# EAGLE board main (EAGLE 9.1.3), part 1 of 2
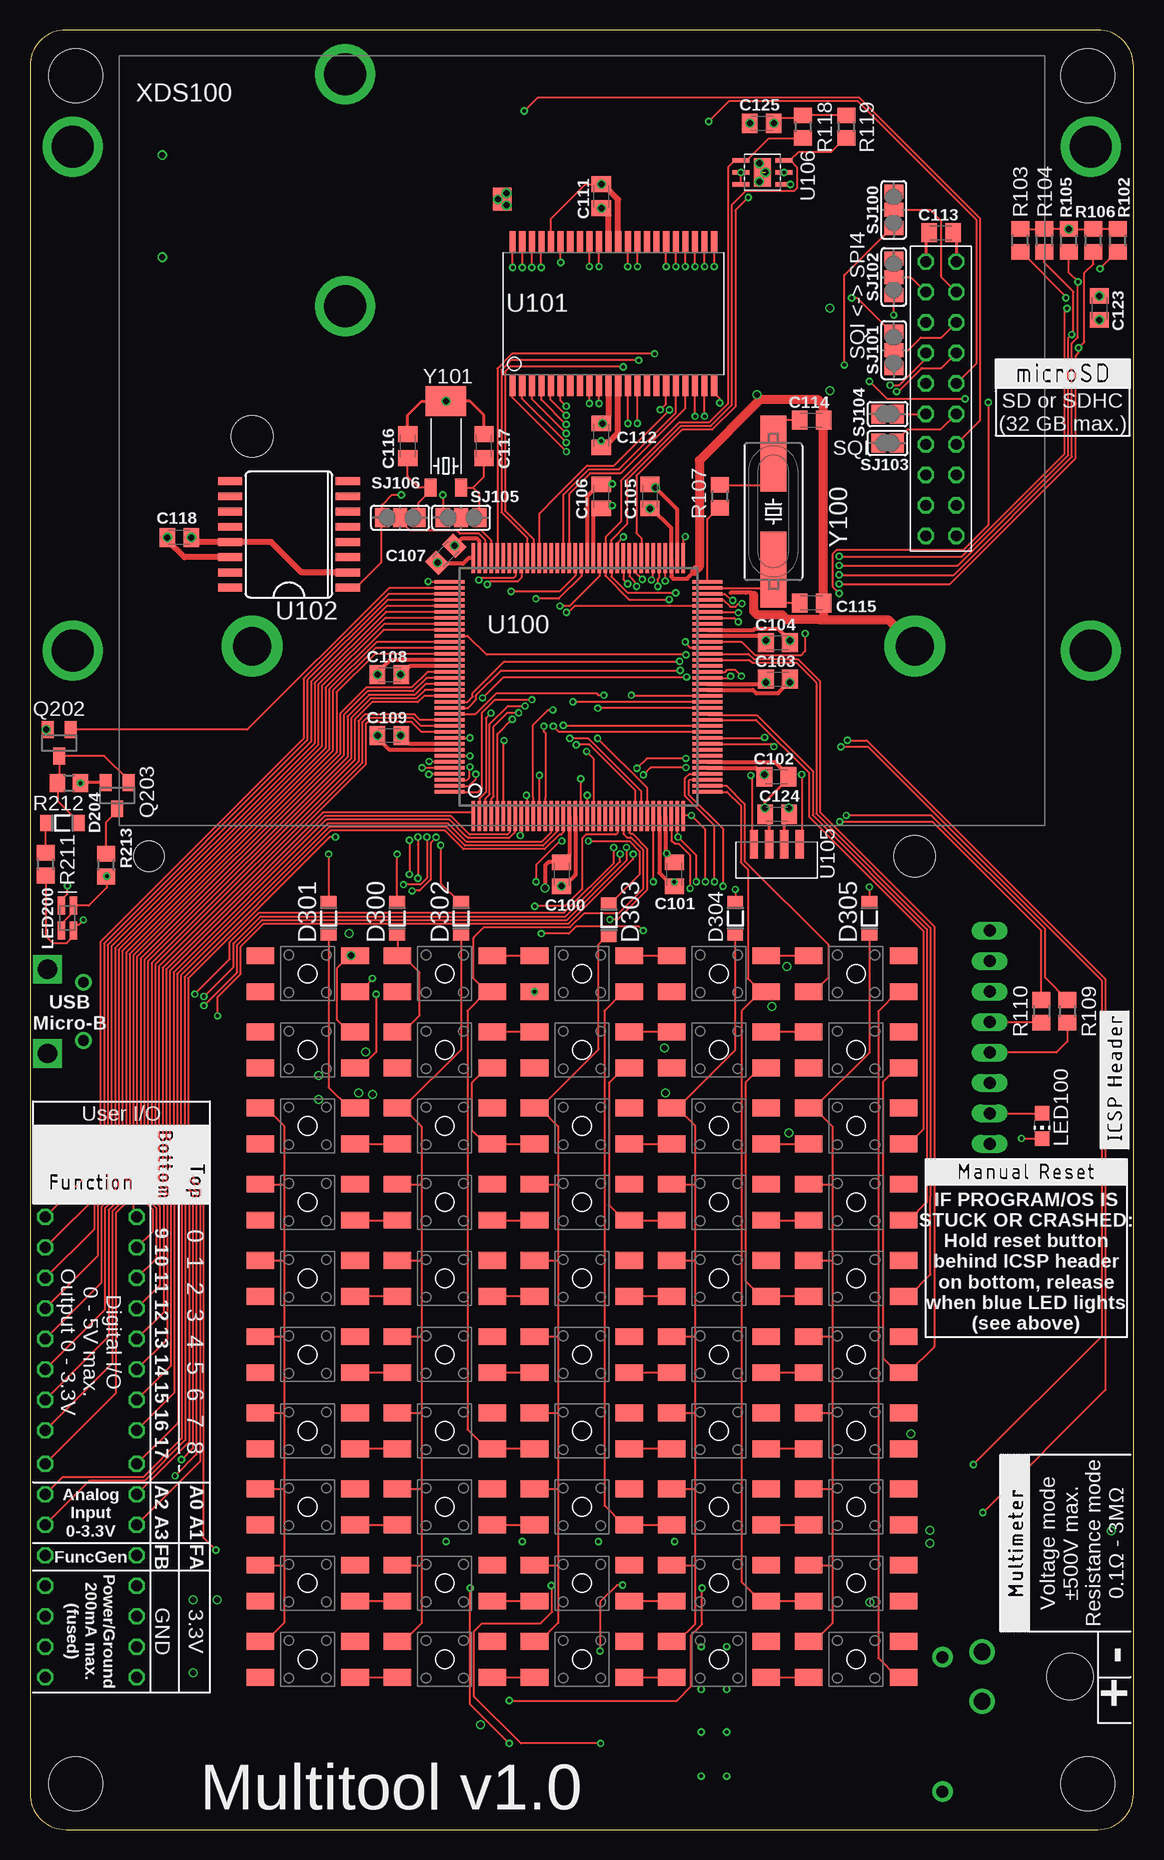
[diagram p7: board, top side]
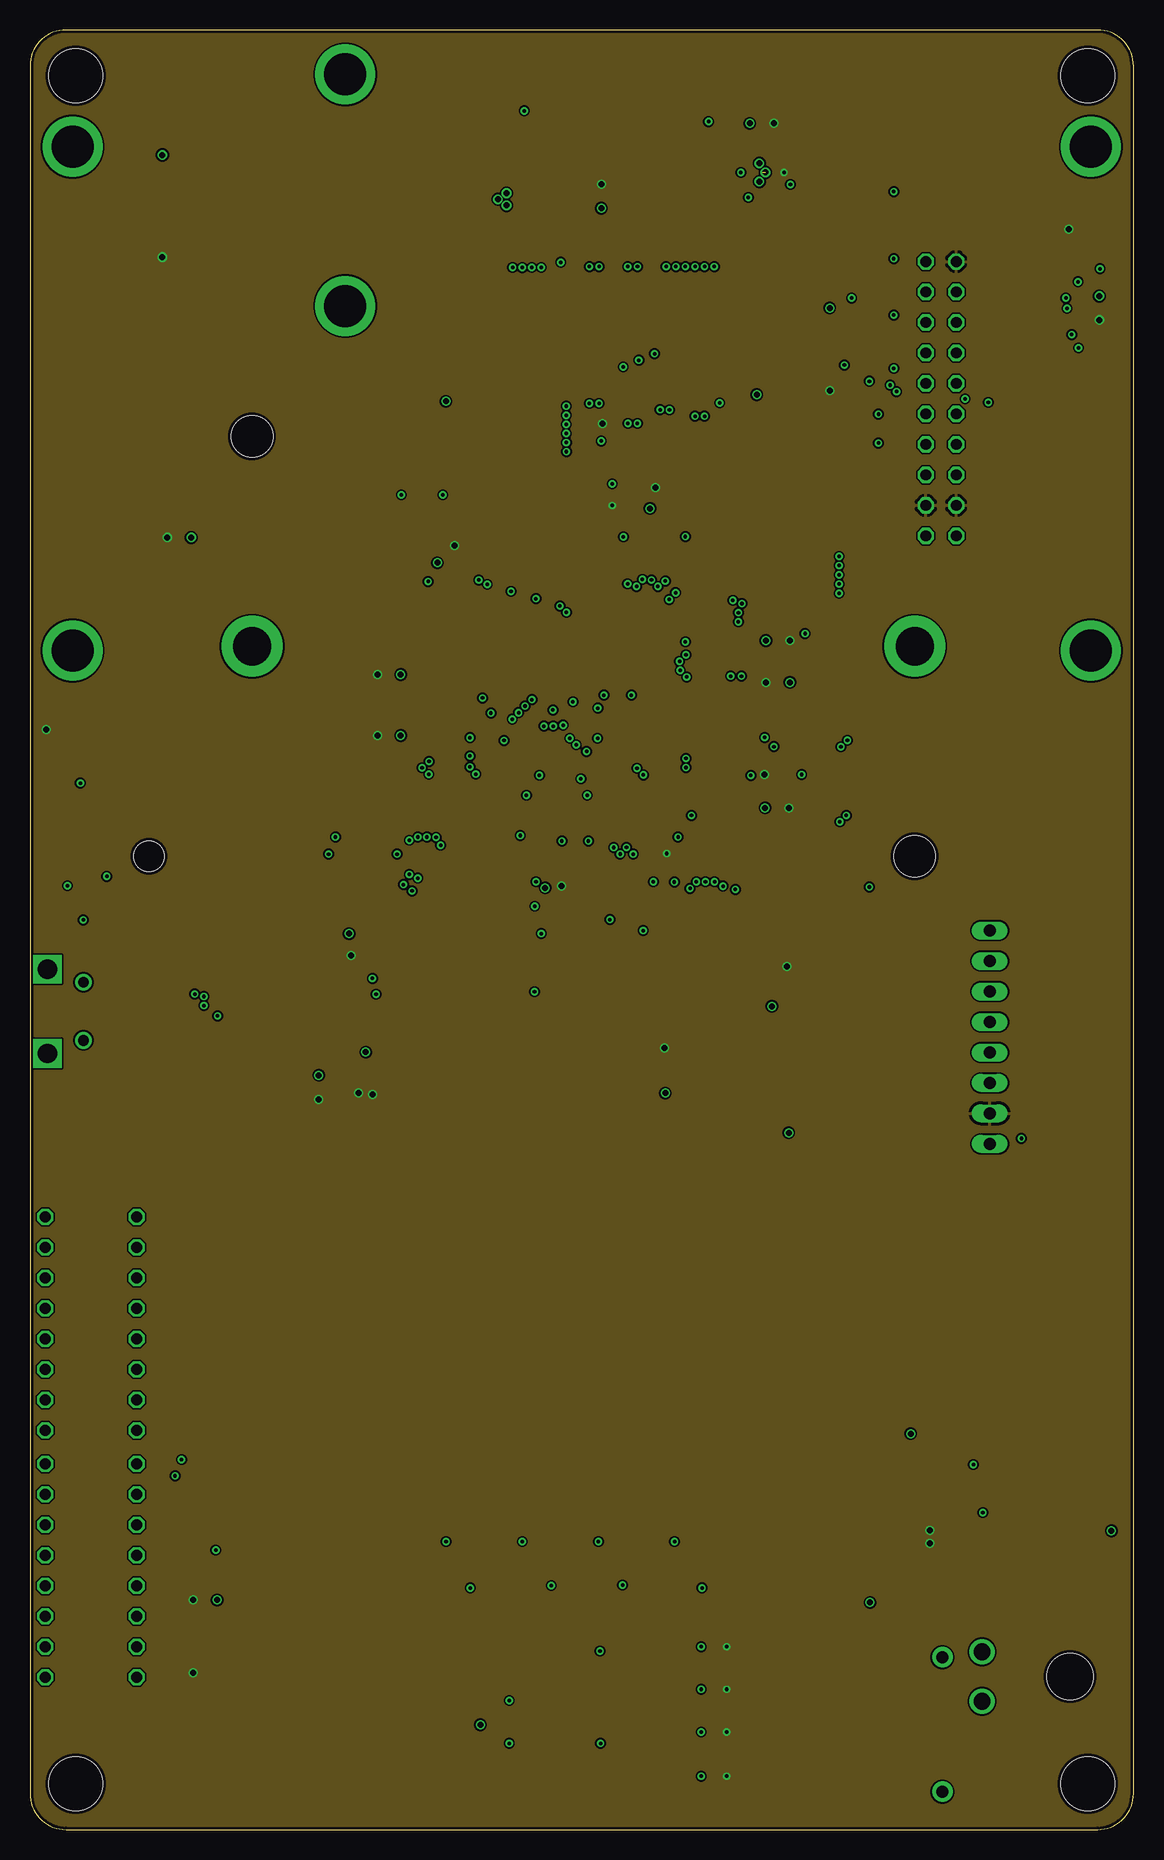
[diagram p8: board, inner layer Route2]
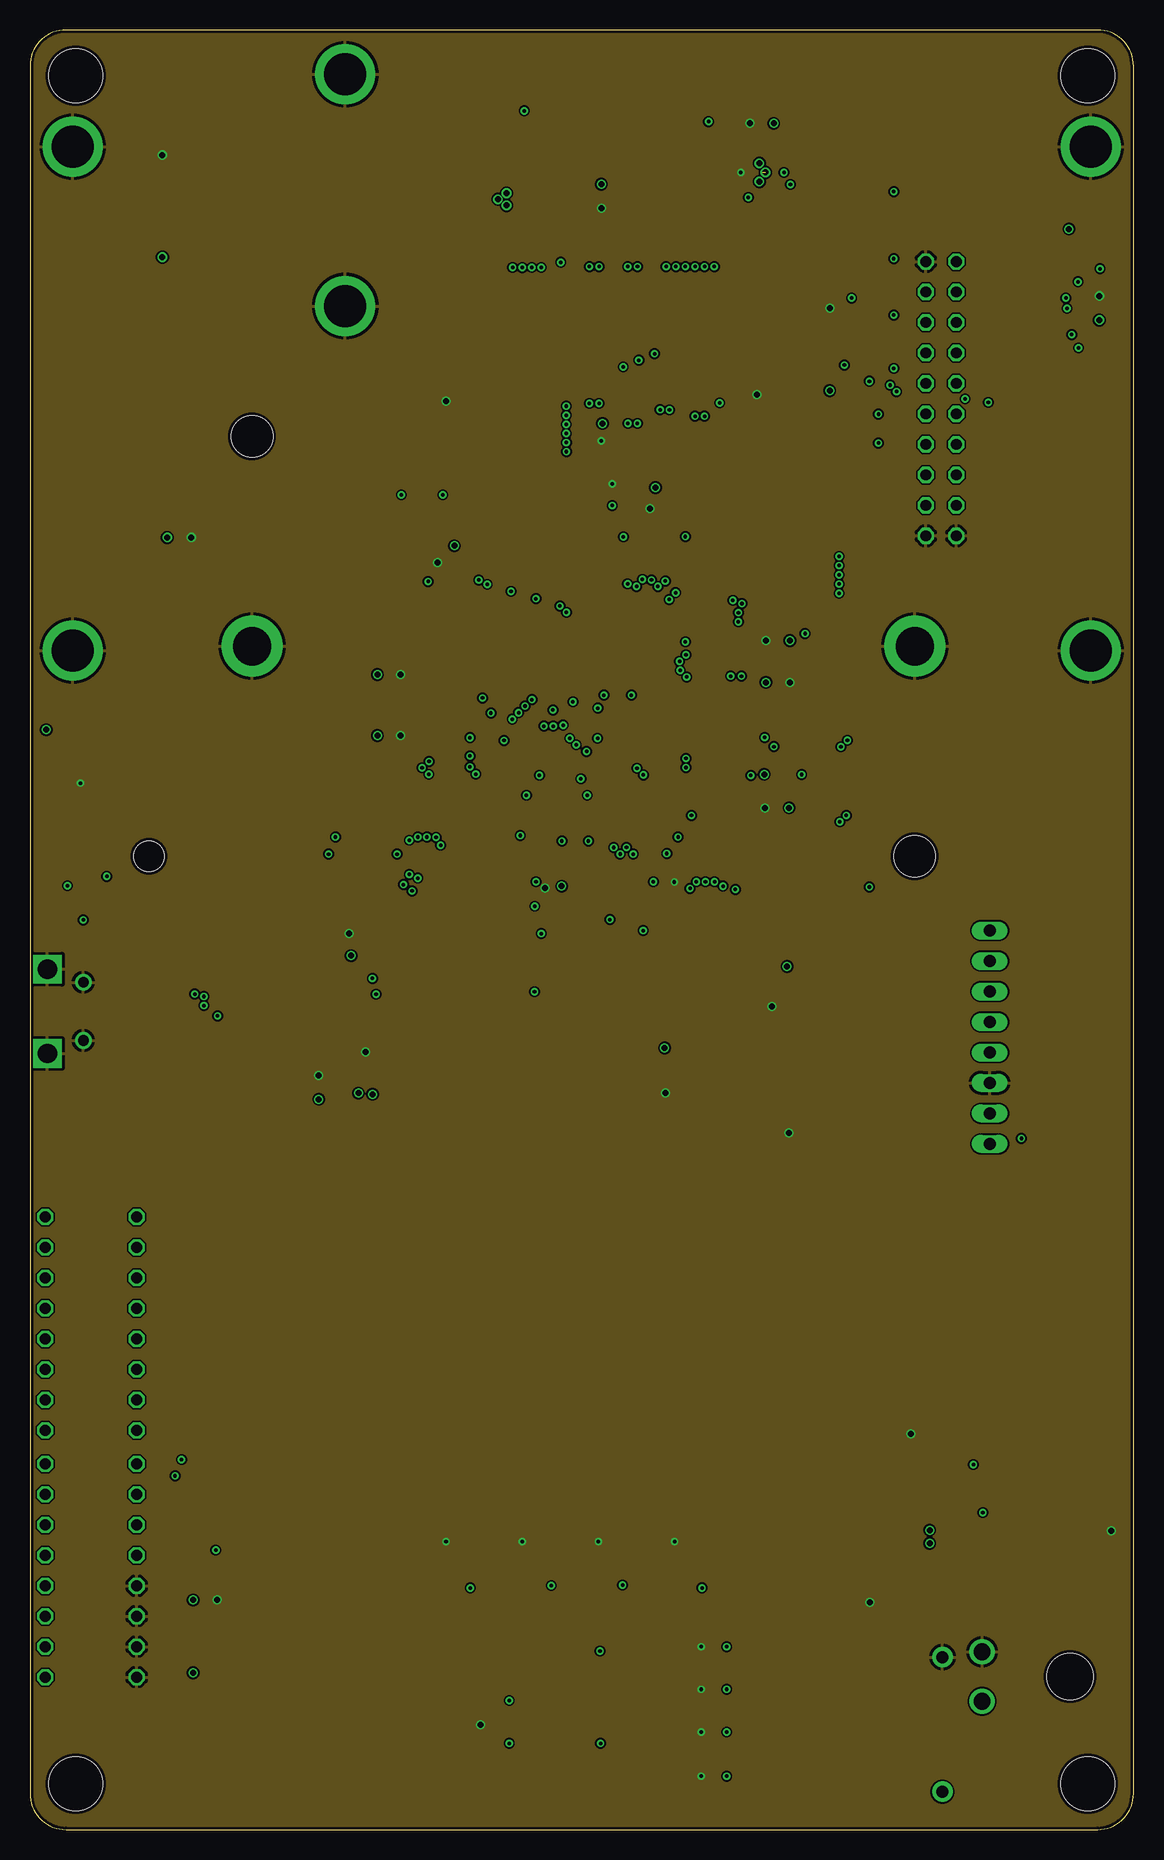
[diagram p9: board, inner layer Route15]
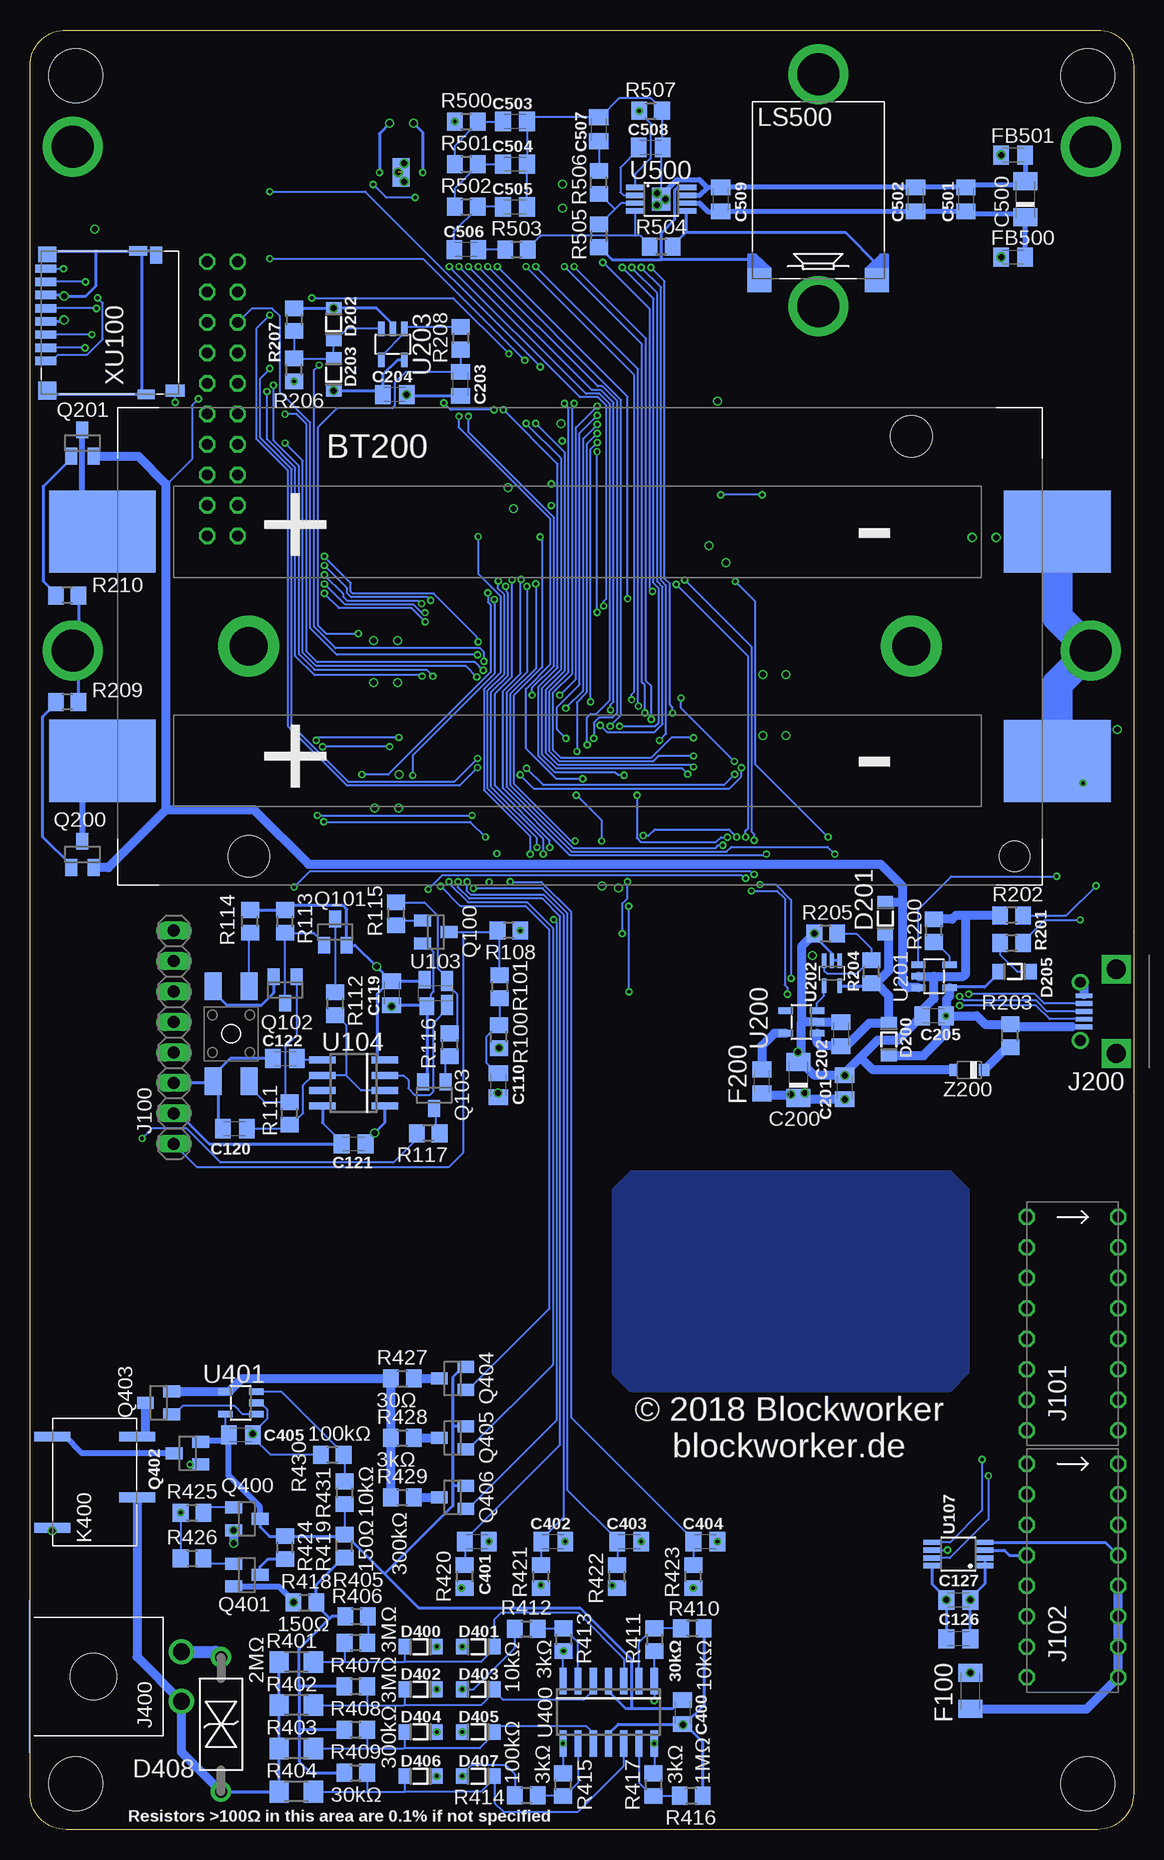
[diagram p10: board, bottom side, seen from below]

Size 92 x 150 mm. Coordinates in mm from the lower left corner, seen from the top.
Outline: 0,147 0,3 arc90 3,0 89,0 arc90 92,3 92,147 arc90 89,150 3,150 arc90 0,147
Copper layers (1+2*15+16): Top 0.035mm / dielectric 0.18mm / Route2 0.017mm / dielectric 1.12mm / Route15 0.017mm / dielectric 0.18mm / Bottom 0.035mm
Design rules "jlcpcb-4l *": minimum track width 6mil, minimum drill 0.25mm, track to track 6mil, track to pad 6mil, pad to pad 6mil, via to via 6mil, smd to smd 6mil, copper to edge 0.25mm, drill to drill 6mil, minimum pad ring 4mil, minimum via ring 4mil, stop-mask expansion 4mil, vias tented up to drill 0.5mm, thermal gap 10mil
Net classes: 1 usb_diffpair: width 0.152 mm, clearance 0.127 mm
Holes 4.5 mm at 88.19,3.81 3.81,3.81 3.81,146.18 88.19,146.18
bKeepout: area 81.8,55.9 to 91.9,76.2

## Footprints (pad centres in the part's own frame; a part is rotated, then mirrored left to right if it is on the bottom)
KEYSTONE-1048 = smd 6.858 x 8.89: 1 10.325,-1.27; 2 29.451,-1.27; 3 10.351,78.334; 4 29.451,78.334 | drill 3.175 pad 5.08: S1 19.888,10.897; S2 19.888,66.142 | hole 3.454: 2.388,66.142; 37.389,10.897 | hole 2.54: 2.388,2.294
C0805K = smd 1.3 x 1.6: 1 -1,0; 2 1,0
C1206K-POL = smd 1.5 x 2: 1 -1.5,0; 2 1.5,0
SOD323 = smd 1 x 1.3: 1 -1.35,0; 2 1.35,0
DO-204AC = drill 1 pad 1.7: 1 -5.6,0; 2 5.6,0
C1206K = smd 1.5 x 2: 1 -1.5,0; 2 1.5,0
1X08 = drill 1 long: 1 -8.89,0; 2 -6.35,0; 3 -3.81,0; 4 -1.27,0; 5 1.27,0; 6 3.81,0; 7 6.35,0; 8 8.89,0
90152-16 = drill 0.9 octagon: 1 -3.81,-8.89; 2 3.81,-8.89; 3 -3.81,-6.35; 4 3.81,-6.35; 5 -3.81,-3.81; 6 3.81,-3.81; 7 -3.81,-1.27; 8 3.81,-1.27; 9 -3.81,1.27; 10 3.81,1.27; 11 -3.81,3.81; 12 3.81,3.81; 13 -3.81,6.35; 14 3.81,6.35; 15 -3.81,8.89; 16 3.81,8.89
ZX62D-B-5PA8 = smd 0.4 x 1.35: 1 3.4,4.125; 2 4.05,4.125; 3 4.7,4.125; 4 5.35,4.125; 5 6,4.125 | drill 1.6 pad 2.375 square: S1 1.188,1.45; S2 8.213,1.45 | drill 0.9 pad 1.4: S3 2.275,4.45; S4 7.125,4.45
TE-770966 = drill 1.4: 1 -2.07,12.67; 2 2.07,12.67 | hole 3.86: 0,5.33
G6L-1F = smd 0.8 x 3: 1 -1.27,-3.54; 2 3.81,-3.54; 3 3.81,3.54; 4 -3.81,3.54
CHIP-LED0805 = smd 1.2 x 1.2: A 0,-1.05; C 0,1.05
0805-DUALLED = smd 1.5 x 0.6: A1 1.05,0.5; A2 1.05,-0.5; K1 -1.05,0.5; K2 -1.05,-0.5
CMS-151135-078S = smd 2 x 2: + -4.9,7.5; - 4.9,7.5 | drill 3.5 pad 5: S1 0,-9.652; S2 0,9.652
SOT23 = smd 1 x 1.4: 1 -0.95,-1.1; 2 0.95,-1.1; 3 0,1.1
R0805 = smd 1.3 x 1.5: 1 -0.95,0; 2 0.95,0
R1206 = smd 1.6 x 1.803: 1 -1.422,0; 2 1.422,0
TL3305_MICROSWITCH = smd 2.3 x 1.4: 1 -1.7,0.75; 2 6.2,0.75; 3 -1.7,3.75; 4 6.2,3.75
SJ_2 = smd 1.168 x 1.6: 1 -1.524,0; 2 0,0; 3 1.524,0
SJ = smd 1.168 x 1.6: 1 -0.762,0; 2 0.762,0
LQFP144-20X20 = smd 0.3 x 2.5: 1 -8.75,-10.75; 2 -8.25,-10.75; 3 -7.75,-10.75; 4 -7.25,-10.75; 5 -6.75,-10.75; 6 -6.25,-10.75; 7 -5.75,-10.75; 8 -5.25,-10.75; 9 -4.75,-10.75; 10 -4.25,-10.75; 11 -3.75,-10.75; 12 -3.25,-10.75; 13 -2.75,-10.75; 14 -2.25,-10.75; 15 -1.75,-10.75; 16 -1.25,-10.75; 17 -0.75,-10.75; 18 -0.25,-10.75; 19 0.25,-10.75; 20 0.75,-10.75; 21 1.25,-10.75; 22 1.75,-10.75; 23 2.25,-10.75; 24 2.75,-10.75; 25 3.25,-10.75; 26 3.75,-10.75; 27 4.25,-10.75; 28 4.75,-10.75; 29 5.25,-10.75; 30 5.75,-10.75; 31 6.25,-10.75; 32 6.75,-10.75; 33 7.25,-10.75; 34 7.75,-10.75; 35 8.25,-10.75; 36 8.75,-10.75; 73 8.75,10.75; 74 8.25,10.75; 75 7.75,10.75; 76 7.25,10.75; 77 6.75,10.75; 78 6.25,10.75; 79 5.75,10.75; 80 5.25,10.75; 81 4.75,10.75; 82 4.25,10.75; 83 3.75,10.75; 84 3.25,10.75; 85 2.75,10.75; 86 2.25,10.75; 87 1.75,10.75; 88 1.25,10.75; 89 0.75,10.75; 90 0.25,10.75; 91 -0.25,10.75; 92 -0.75,10.75; 93 -1.25,10.75; 94 -1.75,10.75; 95 -2.25,10.75; 96 -2.75,10.75; 97 -3.25,10.75; 98 -3.75,10.75; 99 -4.25,10.75; 100 -4.75,10.75; 101 -5.25,10.75; 102 -5.75,10.75; 103 -6.25,10.75; 104 -6.75,10.75; 105 -7.25,10.75; 106 -7.75,10.75; 107 -8.25,10.75; 108 -8.75,10.75 | smd 2.5 x 0.3: 37 10.75,-8.75; 38 10.75,-8.25; 39 10.75,-7.75; 40 10.75,-7.25; 41 10.75,-6.75; 42 10.75,-6.25; 43 10.75,-5.75; 44 10.75,-5.25; 45 10.75,-4.75; 46 10.75,-4.25; 47 10.75,-3.75; 48 10.75,-3.25; 49 10.75,-2.75; 50 10.75,-2.25; 51 10.75,-1.75; 52 10.75,-1.25; 53 10.75,-0.75; 54 10.75,-0.25; 55 10.75,0.25; 56 10.75,0.75; 57 10.75,1.25; 58 10.75,1.75; 59 10.75,2.25; 60 10.75,2.75; 61 10.75,3.25; 62 10.75,3.75; 63 10.75,4.25; 64 10.75,4.75; 65 10.75,5.25; 66 10.75,5.75; 67 10.75,6.25; 68 10.75,6.75; 69 10.75,7.25; 70 10.75,7.75; 71 10.75,8.25; 72 10.75,8.75; 109 -10.75,8.75; 110 -10.75,8.25; 111 -10.75,7.75; 112 -10.75,7.25; 113 -10.75,6.75; 114 -10.75,6.25; 115 -10.75,5.75; 116 -10.75,5.25; 117 -10.75,4.75; 118 -10.75,4.25; 119 -10.75,3.75; 120 -10.75,3.25; 121 -10.75,2.75; 122 -10.75,2.25; 123 -10.75,1.75; 124 -10.75,1.25; 125 -10.75,0.75; 126 -10.75,0.25; 127 -10.75,-0.25; 128 -10.75,-0.75; 129 -10.75,-1.25; 130 -10.75,-1.75; 131 -10.75,-2.25; 132 -10.75,-2.75; 133 -10.75,-3.25; 134 -10.75,-3.75; 135 -10.75,-4.25; 136 -10.75,-4.75; 137 -10.75,-5.25; 138 -10.75,-5.75; 139 -10.75,-6.25; 140 -10.75,-6.75; 141 -10.75,-7.25; 142 -10.75,-7.75; 143 -10.75,-8.25; 144 -10.75,-8.75
TSOP44 = smd 0.508 x 1.8: 1 -8.4,-5.98; 2 -7.6,-5.98; 3 -6.8,-5.98; 4 -6,-5.98; 5 -5.2,-5.98; 6 -4.4,-5.98; 7 -3.6,-5.98; 8 -2.8,-5.98; 9 -2,-5.98; 10 -1.2,-5.98; 11 -0.4,-5.98; 12 0.4,-5.98; 13 1.2,-5.98; 14 2,-5.98; 15 2.8,-5.98; 16 3.6,-5.98; 17 4.4,-5.98; 18 5.2,-5.98; 19 6,-5.98; 20 6.8,-5.98; 21 7.6,-5.98; 22 8.4,-5.98; 23 8.4,5.98; 24 7.6,5.98; 25 6.8,5.98; 26 6,5.98; 27 5.2,5.98; 28 4.4,5.98; 29 3.6,5.98; 30 2.8,5.98; 31 2,5.98; 32 1.2,5.98; 33 0.4,5.98; 34 -0.4,5.98; 35 -1.2,5.98; 36 -2,5.98; 37 -2.8,5.98; 38 -3.6,5.98; 39 -4.4,5.98; 40 -5.2,5.98; 41 -6,5.98; 42 -6.8,5.98; 43 -7.6,5.98; 44 -8.4,5.98
SO16L = smd 0.66 x 2.032: 1 -4.445,-4.902; 2 -3.175,-4.902; 3 -1.905,-4.902; 4 -0.635,-4.902; 5 0.635,-4.902; 6 1.905,-4.902; 7 3.175,-4.902; 8 4.445,-4.902; 9 4.445,4.902; 10 3.175,4.902; 11 1.905,4.902; 12 0.635,4.902; 13 -0.635,4.902; 14 -1.905,4.902; 15 -3.175,4.902; 16 -4.445,4.902
SOT143 = smd 1.2 x 1.44: 1 -0.75,-1.1 | smd 1 x 1.64: 2 0.95,-1; 3 0.95,1 | smd 1 x 1.44: 4 -0.95,1.1
SOIC8 = smd 0.6 x 2.2: 1 -1.905,-2.6; 2 -0.635,-2.6; 3 0.635,-2.6; 4 1.905,-2.6; 5 1.905,2.6; 6 0.635,2.6; 7 -0.635,2.6; 8 -1.905,2.6
VEML7700 = smd 0.7 x 2.4: 1 -1.905,-1.3; 2 -0.635,-1.3; 3 0.635,-1.3; 4 1.905,-1.3
PWSON-6 = smd 1.4 x 0.4: 1 -1.8,1; 2 -1.8,0; 3 -1.8,-1; 4 1.8,-1; 5 1.8,0; 6 1.8,1 | smd 1.4 x 2.4: T1 0,0 | smd 1.4 x 2.4 bottom: T2 0,0
MSOP8 = smd 0.45 x 1.45: 1 -0.975,-2.2; 2 -0.325,-2.2; 3 0.325,-2.2; 4 0.975,-2.2; 5 0.975,2.2; 6 0.325,2.2; 7 -0.325,2.2; 8 -0.975,2.2
SOT23-5L = smd 0.55 x 1.2: 1 -0.95,-1.3; 2 0,-1.3; 3 0.95,-1.3; 4 0.95,1.3; 5 -0.95,1.3
SC70-5 = smd 0.35 x 1.2: 1 -0.65,-1.05; 2 0,-1.05; 3 0.65,-1.05; 4 0.65,1.05; 5 -0.65,1.05
SO14 = smd 0.6 x 2.2: 1 -3.81,-2.6; 2 -2.54,-2.6; 3 -1.27,-2.6; 4 0,-2.6; 5 1.27,-2.6; 6 2.54,-2.6; 7 3.81,-2.6; 8 3.81,2.6; 9 2.54,2.6; 10 1.27,2.6; 11 0,2.6; 12 -1.27,2.6; 13 -2.54,2.6; 14 -3.81,2.6
MSOP8-TP = smd 0.45 x 1.45: 1 -0.975,-2.2; 2 -0.325,-2.2; 3 0.325,-2.2; 4 0.975,-2.2; 5 0.975,2.2; 6 0.325,2.2; 7 -0.325,2.2; 8 -0.975,2.2 | smd 1.89 x 1.57: TP1 0,0 | smd 1.89 x 1.57 bottom: TP2 0,0
NHD_DISPLAY_CONN = drill 0.9 octagon: 1 69.67,46.88; 2 67.13,46.88; 3 69.67,44.34; 4 67.13,44.34; 5 69.67,41.8; 6 67.13,41.8; 7 69.67,39.26; 8 67.13,39.26; 9 69.67,36.72; 10 67.13,36.72; 11 69.67,34.18; 12 67.13,34.18; 13 69.67,31.64; 14 67.13,31.64; 15 69.67,29.1; 16 67.13,29.1; 17 69.67,26.56; 18 67.13,26.56; 19 69.67,24.02; 20 67.13,24.02 | drill 3.5 pad 5: S1 -4,14.45; S2 -4,56.45; S3 80.9,56.45; S4 80.9,14.45
11400841 = smd 0.7 x 1.75: 1 3.2,-5.35; 2 2.1,-5.35; 3 1,-5.35; 4 -0.1,-5.35; 5 -1.2,-5.35; 6 -2.3,-5.35; 7 -3.4,-5.35; 8 -4.5,-5.35 | smd 1.45 x 1: CD1 -5.625,3.875 | smd 1 x 1.55: CD2 5.65,5.45 | smd 1.3 x 1.5: H1 -5.7,-5.225 | smd 1.5 x 1.5: H2 5.65,-5.225 | smd 0.8 x 1.5: H3 -5.975,2.375 | smd 0.8 x 1.4: H4 5.975,3.025
HC49US = smd 6.35 x 2.159: 1 -4.826,0; 2 4.826,0
CMJ206T-CUSTOM = smd 1.5 x 1: 1 3.85,-1.27; 2 3.85,1.27 | smd 2.5 x 3.4: GND -3.35,0
SOD323HE = smd 0.889 x 1.016: 1 -0.254,0.686 | smd 0.635 x 1.016: 2 2.337,0.686

## Placement (x,y rotation side)
BT200  KEYSTONE-1048  [KEYSTONE-1048]  7.62,78.74 90 bottom
C100  0.1µF  [C0805K]  44.32,79.63 270 top
C101  0.1µF  [C0805K]  53.72,79.63 90 top
C102  0.1µF  [C0805K]  62.23,87.76 0 top
C103  0.1µF  [C0805K]  62.36,95.89 0 top
C104  0.1µF  [C0805K]  62.36,98.93 180 top
C105  0.1µF  [C0805K]  51.69,111.12 90 top
C106  0.1µF  [C0805K]  47.62,111.12 270 top
C107  0.1µF  [C0805K]  34.67,106.3 45 top
C108  0.1µF  [C0805K]  29.97,96.27 0 top
C109  0.1µF  [C0805K]  29.97,91.19 0 top
C110  0.1µF  [C0805K]  52.96,62.05 90 bottom
C111  0.1µF  [C0805K]  47.62,136.14 90 top
C112  0.1µF  [C0805K]  47.62,116.2 90 top
C113  0.1µF  [C0805K]  75.95,133.1 180 top
C114  22pF  [C0805K]  65.15,117.47 0 top
C115  22pF  [C0805K]  65.15,102.23 180 top
C116  18pF  [C0805K]  31.5,115.32 90 top
C117  18pF  [C0805K]  37.85,115.32 270 top
C118  0.1µF  [C0805K]  12.45,107.7 0 top
C119  0.1µF  [C0805K]  61.85,69.72 90 bottom
C120  10µF  [C0805K]  74.93,58.42 180 bottom
C121  0.1µF  [C0805K]  65.02,57.15 180 bottom
C122  10nF  [C0805K]  70.74,64.26 0 bottom
C123  0.1µF  [C0805K]  89.15,126.82 90 top
C124  0.1µF  [C0805K]  62.28,84.63 180 top
C125  0.1µF  [C0805K]  61.01,142.21 180 top
C126  10µF  [C0805K]  14.61,15.9 0 bottom
C127  0.1µF  [C0805K]  14.61,19.13 0 bottom
C200  100µF  [C1206K-POL]  27.94,62.48 90 bottom
C201  0.1µF  [C0805K]  24.08,61.87 270 bottom
C202  10µF  [C0805K]  24.38,66.29 270 bottom
C203  1nF?  [C0805K]  56.11,120.5 270 bottom
C204  0.1µF  [C0805K]  61.59,119.61 0 bottom
C205  10µF  [C0805K]  16.64,67.82 0 bottom
C400  0.1µF  [C0805K]  37.59,9.78 270 bottom
C401  1nF?  [C0805K]  54.74,24 0 bottom
C402  1nF?  [C0805K]  48.39,24 0 bottom
C403  1nF?  [C0805K]  42.04,24 0 bottom
C404  1nF?  [C0805K]  35.69,24 0 bottom
C405  0.1µF  [C0805K]  74.42,32.89 180 bottom
C500  100µF  [C1206K-POL]  9.02,135.89 90 bottom
C501  0.1µF  [C0805K]  13.97,135.89 90 bottom
C502  10nF  [C0805K]  18.16,135.89 90 bottom
C503  4.7nF  [C0805K]  51.56,142.37 0 bottom
C504  4.7nF  [C0805K]  51.56,138.81 0 bottom
C505  4.7nF  [C0805K]  51.56,135.25 0 bottom
C506  0.47µF  [C0805K]  55.63,131.7 0 bottom
C507  0.47µF  [C0805K]  44.58,141.73 270 bottom
C508  0.22µF  [C0805K]  40.26,140.21 180 bottom
C509  1µF  [C0805K]  34.42,135.89 270 bottom
D200  BAT60A  [SOD323]  20.4,65.86 270 bottom
D201  BAT60A  [SOD323]  20.7,75.95 90 bottom
D202  BAT60A  [SOD323]  66.67,125.48 90 bottom
D203  BAT60A  [SOD323]  66.67,121.28 90 bottom
D204  BAT60A  [SOD323]  2.69,83.9 0 top
D205  BAT60A  [SOD323]  9.91,71.5 180 bottom
D300  BAT60A  [SOD323]  30.61,75.95 90 top
D301  BAT60A  [SOD323]  24.89,75.95 90 top
D302  BAT60A  [SOD323]  35.94,75.95 90 top
D303  BAT60A  [SOD323]  48.26,75.82 90 top
D304  BAT60A  [SOD323]  58.8,75.95 90 top
D305  BAT60A  [SOD323]  69.98,75.95 90 top
D400  BAT60A  [SOD323]  59.44,15.24 180 bottom
D401  BAT60A  [SOD323]  54.61,15.24 180 bottom
D402  BAT60A  [SOD323]  59.44,11.68 180 bottom
D403  BAT60A  [SOD323]  54.61,11.68 180 bottom
D404  BAT60A  [SOD323]  59.44,8.13 180 bottom
D405  BAT60A  [SOD323]  54.61,8.13 180 bottom
D406  BAT60A  [SOD323]  59.44,4.45 180 bottom
D407  BAT60A  [SOD323]  54.61,4.45 180 bottom
D408  P6KE600CA  [DO-204AC]  76.07,8.76 270 bottom
F100  0.2A FF  [C1206K]  13.59,11.56 270 bottom
F200  1.5A FF  [C0805K]  30.99,62.36 270 bottom
FB500  600Ω 1A  [C0805K]  10.03,131.06 0 bottom
FB501  600Ω 1A  [C0805K]  10.03,139.57 0 bottom
J100  ICSP  [1X08]  80.01,66.04 90 bottom
J101  90152-16  [90152-16]  5.08,42.16 180 bottom
J102  90152-16  [90152-16]  5.08,21.59 180 bottom
J200  ZX62D-B-5PA8  [ZX62D-B-5PA8]  0,63.5 90 bottom
J400  TE-770966  [TE-770966]  92.05,12.75 270 bottom
K400  G6L-1F  [G6L-1F]  86.61,28.96 90 bottom
LED100  BLUE  [CHIP-LED0805]  84.38,58.65 180 top
LED200  R/G  [0805-DUALLED]  3.12,75.97 270 top
LS500  CMS-151135-078S  [CMS-151135-078S]  26.29,136.65 180 bottom
Q100  NMOS  [SOT23]  58.17,74.8 270 bottom
Q101  PMOS  [SOT23]  66.55,74.8 0 bottom
Q102  NMOS  [SOT23]  70.74,69.98 180 bottom
Q103  NMOS  [SOT23]  58.29,61.21 180 bottom
Q200  PMOS  [SOT23]  87.63,81.28 0 bottom
Q201  PMOS  [SOT23]  87.63,115.57 0 bottom
Q202  PMOS  [SOT23]  2.44,90.58 180 top
Q203  NMOS  [SOT23]  7.26,86.18 180 top
Q400  PMOS  [SOT23]  73.91,25.91 270 bottom
Q401  NMOS  [SOT23]  73.91,21.21 270 bottom
Q402  PMOS  [SOT23]  78.87,31.37 90 bottom
Q403  MMBT5087L  [SOT23]  81.28,35.56 90 bottom
Q404  PMOS  [SOT23]  56.77,37.59 90 bottom
Q405  PMOS  [SOT23]  56.77,32.64 90 bottom
Q406  PMOS  [SOT23]  56.77,27.69 90 bottom
R100  10kΩ  [R0805]  52.91,66.09 90 bottom
R101  1kΩ  [R0805]  52.86,70.26 270 bottom
R102  100kΩ  [R0805]  90.68,132.46 90 top
R103  100kΩ  [R0805]  82.55,132.46 90 top
R104  100kΩ  [R0805]  84.58,132.46 90 top
R105  100kΩ  [R0805]  86.61,132.46 90 top
R106  100kΩ  [R0805]  88.65,132.46 90 top
R107  1kΩ  [R0805]  57.53,111.12 90 top
R108  47Ω  [R0805]  52.07,74.93 180 bottom
R109  47Ω  [R0805]  86.49,68.2 270 top
R110  47Ω  [R0805]  84.33,68.2 270 top
R111  280kΩ  [R0805]  70.36,59.69 90 bottom
R112  1kΩ  [R0805]  66.55,68.83 90 bottom
R113  10kΩ  [R0805]  70.74,75.69 90 bottom
R114  10kΩ  [R0805]  73.66,75.69 90 bottom
R115  47Ω  [R0805]  61.47,76.33 90 bottom
R116  47Ω  [R0805]  57.02,65.41 270 bottom
R117  470Ω  [R0805]  58.8,58.04 180 bottom
R118  10kΩ  [R0805]  64.44,141.94 270 top
R119  10kΩ  [R0805]  68.05,141.94 270 top
R200  2kΩ  [R0805]  16.64,74.93 90 bottom
R201  2kΩ  [R0805]  10.16,73.91 0 bottom
R202  1kΩ  [R0805]  10.16,76.2 180 bottom
R203  1kΩ  [R0805]  10.29,66.17 90 bottom
R204  300kΩ  [R0805]  21.84,71.5 90 bottom
R205  187kΩ  [R0805]  25.65,74.68 180 bottom
R206  200kΩ  [R0805]  69.98,121.67 90 bottom
R207  200kΩ  [R0805]  69.98,125.86 270 bottom
R208  47Ω?  [R0805]  56.11,124.31 270 bottom
R209  47Ω  [R0805]  88.9,93.98 180 bottom
R210  47Ω  [R0805]  88.9,102.87 180 bottom
R211  470Ω  [R0805]  1.32,80.47 90 top
R212  10kΩ  [R0805]  3.25,87.22 0 top
R213  470Ω  [R0805]  6.35,80.39 90 top
R401  2MΩ 0.1%  [R1206]  69.8,13.97 0 bottom
R402  10MΩ 1%  [R1206]  69.8,10.36 0 bottom
R403  10MΩ 1%  [R1206]  69.8,6.76 0 bottom
R404  10MΩ 1%  [R1206]  69.8,3.15 0 bottom
R405  3MΩ 0.1%  [R0805]  64.77,17.78 0 bottom
R406  3MΩ 0.1%  [R0805]  64.82,15.57 180 bottom
R407  3MΩ 0.1%  [R0805]  64.85,11.94 0 bottom
R408  300kΩ 0.1%  [R0805]  64.85,8.33 0 bottom
R409  30kΩ 0.1%  [R0805]  64.85,4.72 0 bottom
R410  10kΩ 0.1%  [R0805]  36.78,16.79 0 bottom
R411  30kΩ 0.1%  [R0805]  39.93,15.82 270 bottom
R412  10kΩ 0.1%  [R0805]  50.62,16.74 0 bottom
R413  3kΩ 0.1%  [R0805]  47.52,15.82 270 bottom
R414  100kΩ 0.1%  [R0805]  50.62,2.84 0 bottom
R415  3kΩ 0.1%  [R0805]  47.55,3.73 90 bottom
R416  1MΩ 0.1%  [R0805]  36.88,2.79 180 bottom
R417  3kΩ 0.1%  [R0805]  40.01,3.73 90 bottom
R418  150Ω 0.1%  [R0805]  69.09,18.92 0 bottom
R419  150Ω 0.1%  [R0805]  65.79,23.62 90 bottom
R420  47Ω?  [R0805]  55.75,21.08 90 bottom
R421  47Ω?  [R0805]  49.4,21.08 90 bottom
R422  47Ω?  [R0805]  43.05,21.08 90 bottom
R423  47Ω?  [R0805]  36.7,21.08 90 bottom
R424  47Ω  [R0805]  70.74,23.5 90 bottom
R425  47Ω  [R0805]  78.49,26.42 0 bottom
R426  47Ω  [R0805]  78.49,22.61 0 bottom
R427  30Ω 0.1%  [R0805]  60.96,37.59 0 bottom
R428  3kΩ 0.1%  [R0805]  60.96,32.64 0 bottom
R429  300kΩ 0.1%  [R0805]  60.96,27.69 0 bottom
R430  100kΩ 0.1%  [R0805]  66.8,31.24 0 bottom
R431  10kΩ 0.1%  [R0805]  65.79,28.07 270 bottom
R500  1kΩ  [R0805]  55.63,142.37 0 bottom
R501  1kΩ  [R0805]  55.63,138.81 0 bottom
R502  1kΩ  [R0805]  55.63,135.25 0 bottom
R503  10kΩ 1%  [R0805]  51.44,131.7 0 bottom
R504  20kΩ 1%  [R0805]  39.37,131.95 0 bottom
R505  20kΩ 1%  [R0805]  44.58,132.84 270 bottom
R506  10kΩ 1%  [R0805]  44.58,137.29 90 bottom
R507  100kΩ  [R0805]  40.26,143.26 0 bottom
S100  TL3305  [TL3305_MICROSWITCH]  77.47,68.58 270 bottom
S300  TL3305  [TL3305_MICROSWITCH]  20.9,69.09 0 top
S301  TL3305  [TL3305_MICROSWITCH]  32.33,69.09 0 top
S302  TL3305  [TL3305_MICROSWITCH]  43.76,69.09 0 top
S303  TL3305  [TL3305_MICROSWITCH]  55.19,69.09 0 top
S304  TL3305  [TL3305_MICROSWITCH]  66.62,69.09 0 top
S305  TL3305  [TL3305_MICROSWITCH]  20.9,62.74 0 top
S306  TL3305  [TL3305_MICROSWITCH]  32.33,62.74 0 top
S307  TL3305  [TL3305_MICROSWITCH]  43.76,62.74 0 top
S308  TL3305  [TL3305_MICROSWITCH]  55.19,62.74 0 top
S309  TL3305  [TL3305_MICROSWITCH]  66.62,62.74 0 top
S310  TL3305  [TL3305_MICROSWITCH]  20.9,56.39 0 top
S311  TL3305  [TL3305_MICROSWITCH]  32.33,56.39 0 top
S312  TL3305  [TL3305_MICROSWITCH]  43.76,56.39 0 top
S313  TL3305  [TL3305_MICROSWITCH]  55.19,56.39 0 top
S314  TL3305  [TL3305_MICROSWITCH]  66.62,56.39 0 top
S315  TL3305  [TL3305_MICROSWITCH]  20.9,50.04 0 top
S316  TL3305  [TL3305_MICROSWITCH]  32.33,50.04 0 top
S317  TL3305  [TL3305_MICROSWITCH]  43.76,50.04 0 top
S318  TL3305  [TL3305_MICROSWITCH]  55.19,50.04 0 top
S319  TL3305  [TL3305_MICROSWITCH]  66.62,50.04 0 top
S320  TL3305  [TL3305_MICROSWITCH]  20.9,43.69 0 top
S321  TL3305  [TL3305_MICROSWITCH]  32.33,43.69 0 top
S322  TL3305  [TL3305_MICROSWITCH]  43.76,43.69 0 top
S323  TL3305  [TL3305_MICROSWITCH]  55.19,43.69 0 top
S324  TL3305  [TL3305_MICROSWITCH]  66.62,43.69 0 top
S325  TL3305  [TL3305_MICROSWITCH]  20.9,37.34 0 top
S326  TL3305  [TL3305_MICROSWITCH]  32.33,37.34 0 top
S327  TL3305  [TL3305_MICROSWITCH]  43.76,37.34 0 top
S328  TL3305  [TL3305_MICROSWITCH]  55.19,37.34 0 top
S329  TL3305  [TL3305_MICROSWITCH]  66.62,37.34 0 top
S330  TL3305  [TL3305_MICROSWITCH]  20.9,30.99 0 top
S331  TL3305  [TL3305_MICROSWITCH]  32.33,30.99 0 top
S332  TL3305  [TL3305_MICROSWITCH]  43.76,30.99 0 top
S333  TL3305  [TL3305_MICROSWITCH]  55.19,30.99 0 top
S334  TL3305  [TL3305_MICROSWITCH]  66.62,30.99 0 top
S335  TL3305  [TL3305_MICROSWITCH]  20.9,24.64 0 top
S336  TL3305  [TL3305_MICROSWITCH]  32.33,24.64 0 top
S337  TL3305  [TL3305_MICROSWITCH]  43.76,24.64 0 top
S338  TL3305  [TL3305_MICROSWITCH]  55.19,24.64 0 top
S339  TL3305  [TL3305_MICROSWITCH]  66.62,24.64 0 top
S340  TL3305  [TL3305_MICROSWITCH]  20.9,18.29 0 top
S341  TL3305  [TL3305_MICROSWITCH]  32.33,18.29 0 top
S342  TL3305  [TL3305_MICROSWITCH]  43.76,18.29 0 top
S343  TL3305  [TL3305_MICROSWITCH]  55.19,18.29 0 top
S344  TL3305  [TL3305_MICROSWITCH]  66.62,18.29 0 top
S345  TL3305  [TL3305_MICROSWITCH]  20.9,11.94 0 top
S346  TL3305  [TL3305_MICROSWITCH]  32.33,11.94 0 top
S347  TL3305  [TL3305_MICROSWITCH]  43.76,11.94 0 top
S348  TL3305  [TL3305_MICROSWITCH]  55.19,11.94 0 top
S349  TL3305  [TL3305_MICROSWITCH]  66.62,11.94 0 top
SJ100  SPI4<->SQI  [SJ_2]  72.01,135 270 top
SJ101  SPI4<->SQI  [SJ_2]  72.01,123.32 270 top
SJ102  SPI4<->SQI  [SJ_2]  72.01,129.41 270 top
SJ103  SQI  [SJ]  71.5,115.57 0 top
SJ104  SQI  [SJ]  71.5,117.98 0 top
SJ105  EXT<->Y  [SJ_2]  35.94,109.35 0 top
SJ106  EXT<->Y  [SJ_2]  30.86,109.35 0 top
U100  PIC32MZ-EF-144  [LQFP144-20X20]  45.72,95.25 0 top
U101  IS62WV10248EBLL  [TSOP44]  48.64,126.36 0 top
U102  DS32KHZ  [SO16L]  21.59,107.95 90 top
U103  MAX6816?  [SOT143]  58.17,69.72 0 bottom
U104  TLC555-D  [SOIC8]  65.02,62.23 90 bottom
U105  VEML7700  [VEML7700]  62.26,80.82 180 top
U106  HDC2080  [PWSON-6]  61.06,138.13 0 top
U107  DAC8552  [MSOP8]  14.61,22.96 90 bottom
U200  TLV757P  [SOT23-5L]  27.69,67.31 90 bottom
U201  MCP73831  [SOT23-5L]  16.64,71.12 270 bottom
U202  MAX6776X  [SC70-5]  25.15,71.37 180 bottom
U203  AD6805  [SOT23-5L]  61.75,123.8 180 bottom
U400  AD6808  [SO14]  43.76,9.78 180 bottom
U401  AD6805  [SOT23-5L]  74.42,35.56 90 bottom
U500  TPA6205A1  [MSOP8-TP]  39.37,135.89 270 bottom
XDS100  NHD-3.5-320240FT  [NHD_DISPLAY_CONN]  7.55,83.82 0 top
XU100  11400841  [11400841]  85.34,125.6 270 bottom
Y100  ABLS-12.000MHZ  [HC49US]  61.98,109.86 90 top
Y101  CMJ206T  [CMJ206T-CUSTOM]  34.67,115.7 270 top
Z200  5.6V  [SOD323HE]  12.7,64.01 180 bottom